# Altium schematic sheet Flash.SchDoc
size A4
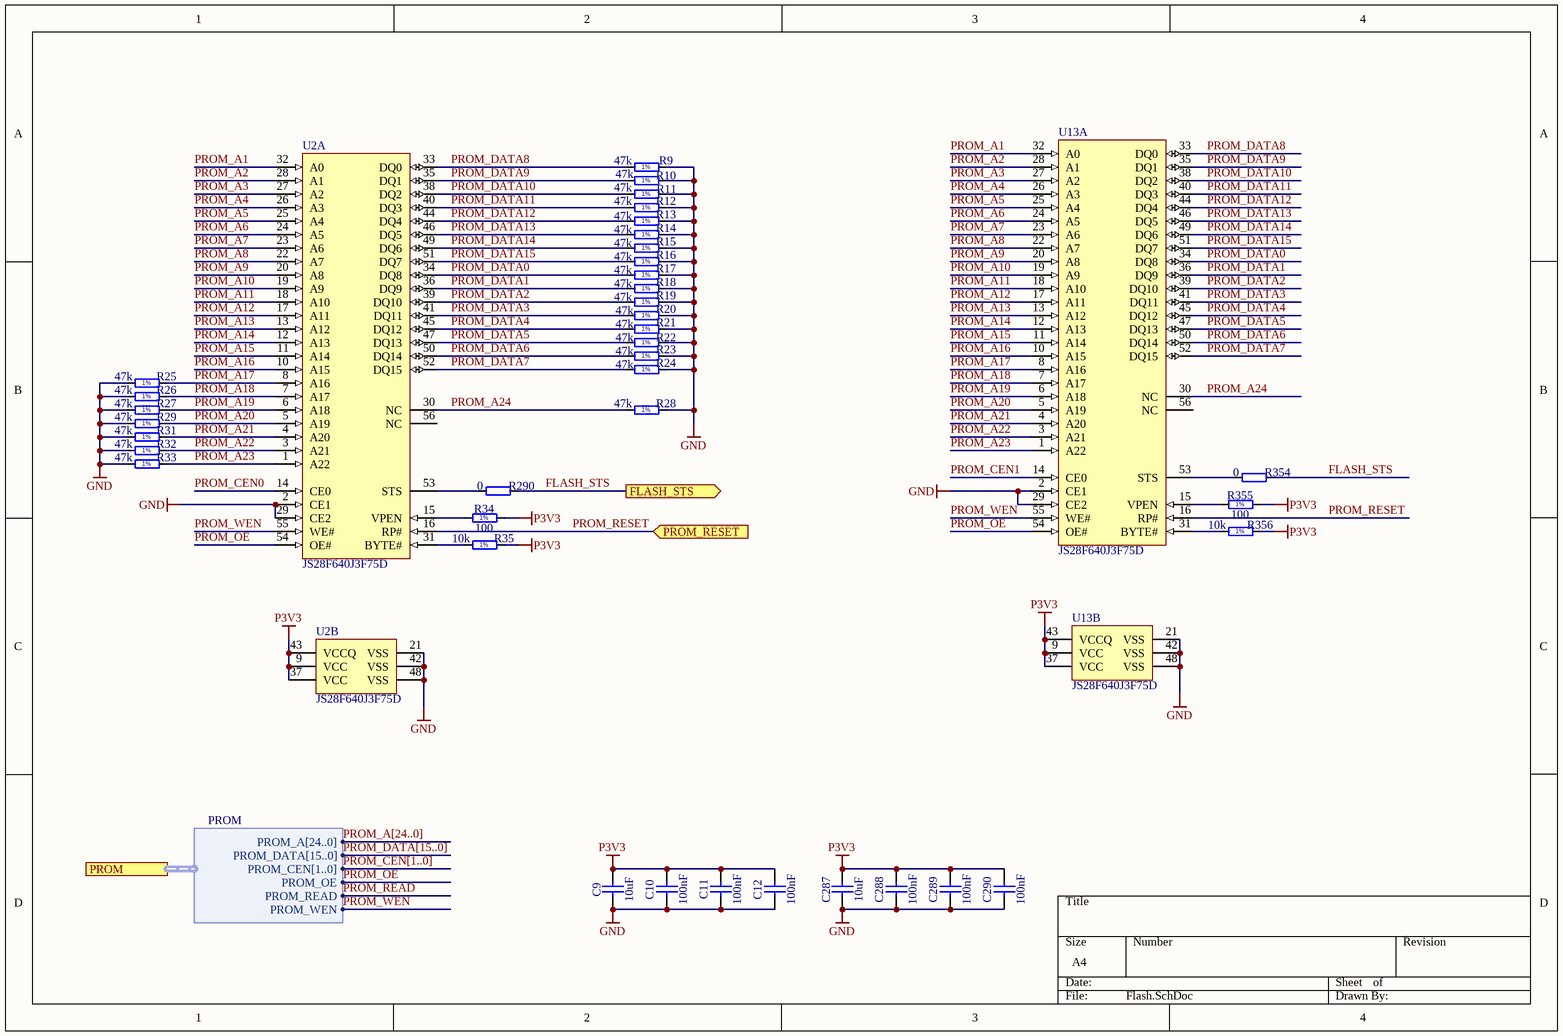
[diagram p0: Flash.SchDoc]

## Parts
C9  10uF  [CAPC2012X135N]
C10  100nF  [CAPC0603X33N]
C11  100nF  [CAPC0603X33N]
C12  100nF  [CAPC0603X33N]
C287  10uF  [CAPC2012X135N]
C288  100nF  [CAPC0603X33N]
C289  100nF  [CAPC0603X33N]
C290  100nF  [CAPC0603X33N]
R9  47k  [RESC1005X40N]
R10  47k  [RESC1005X40N]
R11  47k  [RESC1005X40N]
R12  47k  [RESC1005X40N]
R13  47k  [RESC1005X40N]
R14  47k  [RESC1005X40N]
R15  47k  [RESC1005X40N]
R16  47k  [RESC1005X40N]
R17  47k  [RESC1005X40N]
R18  47k  [RESC1005X40N]
R19  47k  [RESC1005X40N]
R20  47k  [RESC1005X40N]
R21  47k  [RESC1005X40N]
R22  47k  [RESC1005X40N]
R23  47k  [RESC1005X40N]
R24  47k  [RESC1005X40N]
R25  47k  [RESC1005X40N]
R26  47k  [RESC1005X40N]
R27  47k  [RESC1005X40N]
R28  47k  [RESC1005X40N]
R29  47k  [RESC1005X40N]
R31  47k  [RESC1005X40N]
R32  47k  [RESC1005X40N]
R33  47k  [RESC1005X40N]
R34  100  [RESC1005X40N]
R35  10k  [RESC1005X40N]
R290  0  [RESC0603X28N]
R354  0  [RESC0603X28N]
R355  100  [RESC1005X40N]
R356  10k  [RESC1005X40N]
U2  JS28F640J3F75D  [MICT-JS-56_N]  (parts A,B of 2)
U13  JS28F640J3F75D  [MICT-JS-56_N]  (parts A,B of 2)

## Ports
FLASH_STS (out), PROM (harness PROM), PROM_RESET (in)

## Harnesses
PROM: PROM_A[24..0], PROM_DATA[15..0], PROM_CEN[1..0], PROM_OE, PROM_READ, PROM_WEN

## Nets
GND: C9.1 C10.2 C11.2 C12.2 C287.1 C288.2 C289.2 C290.2 R9.2 R10.2 R11.2 R12.2 R13.2 R14.2 R15.2 R16.2 R17.2 R18.2 R19.2 R20.2 R21.2 R22.2 R23.2 R24.2 R25.1 R26.1 R27.1 R28.2 R29.1 R31.1 R32.1 R33.1 U2.2(CE1) U2.21(VSS) U2.29(CE2) U2.42(VSS) U2.48(VSS) U13.2(CE1) U13.21(VSS) U13.29(CE2) U13.42(VSS) U13.48(VSS)
P3V3: C9.2 C10.1 C11.1 C12.1 C287.2 C288.1 C289.1 C290.1 R34.2 R35.2 R355.2 R356.2 U2.9(VCC) U2.37(VCC) U2.43(VCCQ) U13.9(VCC) U13.37(VCC) U13.43(VCCQ)
FLASH_STS: R290.2 R354.2 ; port FLASH_STS
PROM_A1: U2.32(A0) U13.32(A0)
PROM_A2: U2.28(A1) U13.28(A1)
PROM_A3: U2.27(A2) U13.27(A2)
PROM_A4: U2.26(A3) U13.26(A3)
PROM_A5: U2.25(A4) U13.25(A4)
PROM_A6: U2.24(A5) U13.24(A5)
PROM_A7: U2.23(A6) U13.23(A6)
PROM_A8: U2.22(A7) U13.22(A7)
PROM_A9: U2.20(A8) U13.20(A8)
PROM_A10: U2.19(A9) U13.19(A9)
PROM_A11: U2.18(A10) U13.18(A10)
PROM_A12: U2.17(A11) U13.17(A11)
PROM_A13: U2.13(A12) U13.13(A12)
PROM_A14: U2.12(A13) U13.12(A13)
PROM_A15: U2.11(A14) U13.11(A14)
PROM_A16: U2.10(A15) U13.10(A15)
PROM_A17: R25.2 U2.8(A16) U13.8(A16)
PROM_A18: R26.2 U2.7(A17) U13.7(A17)
PROM_A19: R27.2 U2.6(A18) U13.6(A18)
PROM_A20: R29.2 U2.5(A19) U13.5(A19)
PROM_A21: R31.2 U2.4(A20) U13.4(A20)
PROM_A22: R32.2 U2.3(A21) U13.3(A21)
PROM_A23: R33.2 U2.1(A22) U13.1(A22)
PROM_A24: R28.1 U2.30(NC) U13.30(NC)
PROM_CEN0: U2.14(CE0)
PROM_CEN1: U13.14(CE0)
PROM_DATA0: R17.1 U2.34(DQ8) U13.34(DQ8)
PROM_DATA1: R18.1 U2.36(DQ9) U13.36(DQ9)
PROM_DATA2: R19.1 U2.39(DQ10) U13.39(DQ10)
PROM_DATA3: R20.1 U2.41(DQ11) U13.41(DQ11)
PROM_DATA4: R21.1 U2.45(DQ12) U13.45(DQ12)
PROM_DATA5: R22.1 U2.47(DQ13) U13.47(DQ13)
PROM_DATA6: R23.1 U2.50(DQ14) U13.50(DQ14)
PROM_DATA7: R24.1 U2.52(DQ15) U13.52(DQ15)
PROM_DATA8: R9.1 U2.33(DQ0) U13.33(DQ0)
PROM_DATA9: R10.1 U2.35(DQ1) U13.35(DQ1)
PROM_DATA10: R11.1 U2.38(DQ2) U13.38(DQ2)
PROM_DATA11: R12.1 U2.40(DQ3) U13.40(DQ3)
PROM_DATA12: R13.1 U2.44(DQ4) U13.44(DQ4)
PROM_DATA13: R14.1 U2.46(DQ5) U13.46(DQ5)
PROM_DATA14: R15.1 U2.49(DQ6) U13.49(DQ6)
PROM_DATA15: R16.1 U2.51(DQ7) U13.51(DQ7)
PROM_OE: U2.54(OE#) U13.54(OE#) ; port PROM.PROM_OE
PROM_READ: port PROM.PROM_READ
PROM_RESET: U2.16(RP#) U13.16(RP#) ; port PROM_RESET
PROM_WEN: U2.55(WE#) U13.55(WE#) ; port PROM.PROM_WEN
NetR34_1: R34.1 U2.15(VPEN)
NetR35_1: R35.1 U2.31(BYTE#)
NetR290_1: R290.1 U2.53(STS)
NetR354_1: R354.1 U13.53(STS)
NetR355_1: R355.1 U13.15(VPEN)
NetR356_1: R356.1 U13.31(BYTE#)

Not connected (* = marked no-connect by the designer): U2 56(NC); U13 56(NC)

## Buses and harness runs
bus PROM_A[24..0]
bus PROM_CEN[1..0]
bus PROM_DATA[15..0]

## Notes on the sheet
- (in symbol R0402_10K_1%_0.0625W_100PPM) 1%
- (in symbol R0402_47K_1%_0.0625W_100PPM) 1%
- (in symbol R0402_100R_1%_0.0625W_100PPM) 1%

## Library data of the parts
C9 C287 = CC0805_10UF_16V_10%_X5R: Non-polarised capacitor; Part Description: SMD Multilayer Chip Ceramic Capacitor; Manufacturer: GENERIC; Manufacturer1 Part Number: C0805C106K4PAC; Voltage: 16V; TC: X5R; Tolerance: ±10%; Part Number: CC0805_10UF_16V_10%_X5R; Component Kind: Standard; Component Type: Standard; Pin Count: 2; Value: 10uF; Status: Preferred; Manufacturer Part Number: CC0805_10UF_16V_10%_X5R; Case: 0805; Mounted: Yes; Socket: No; SMD: Yes; Sense: No; Manufacturer1 Example: KEMET; Manufacturer1 ComponentHeight: 1.4mm; HelpURL: \\cern.ch\dfs\Applications\Altium\Datasheets\CC1206_X5R_KEMET.pdf; Author: CERN DEM JLC; CreateDate: 03.12.2007; LatestRevisionDate: 03.12.2007
C10-C12 C288-C290 = CC0201_100NF_6.3V_10%_X5R: Non-polarised capacitor; Manufacturer: GENERIC; Part Description: SMD Multilayer Chip Ceramic Capacitor; Manufacturer1 Part Number: 02016D104KAT2A; Voltage: 6.3V; TC: X5R; Tolerance: ±10%; Part Number: CC0201_100NF_6.3V_10%_X5R; Component Kind: Standard; Component Type: Standard; Pin Count: 2; Value: 100nF; Status: Not Recommended; Manufacturer Part Number: CC0201_100NF_6.3V_10%_X5R; Case: 0201; Mounted: Yes; Socket: No; SMD: Yes; Sense: No; Manufacturer1 Example: AVX; Manufacturer1 ComponentHeight: 0.33mm; HelpURL: \\cern.ch\dfs\Applications\Altium\Datasheets\CC0201_X5R_AVX.pdf; Author: CERN DEM JLC; CreateDate: 03/12/2007; LatestRevisionDate: 03/12/2007
R9-R29 R31-R33 = R0402_47K_1%_0.0625W_100PPM: Resistor - 1%; Part Description: General Purpose Thick Film Chip Resistor; Manufacturer: GENERIC; Manufacturer1 Part Number: 232270675103L; TC: ±100ppm/°C; PressFit: No; Part Number: R0402_47K_1%_0.0625W_100PPM; Component Kind: Standard; Component Type: Standard; Pin Count: 2; Value: 47k; Status: Not Recommended; Power: 0.0625W; Tolerance: ±1%; Manufacturer Part Number: R0402_47K_1%_0.0625W_100PPM; Case: 0402; Mounted: Yes; Sense: No; Socket: No; SMD: Yes; Manufacturer1 Example: YAGEO PHYCOMP; Manufacturer1 ComponentHeight: 0.4mm; HelpURL: \\cern.ch\dfs\Applications\Altium\Datasheets\R0402_Phycomp_RC0402.pdf; Author: CERN DEM JLC; CreateDate: 03.12.2007; LatestRevisionDate: 17.10.2012
R34 R355 = R0402_100R_1%_0.0625W_100PPM: Resistor - 1%; Part Description: General Purpose Thick Film Chip Resistor; Manufacturer: GENERIC; Manufacturer1 Part Number: 232270671001L; TC: ±100ppm/°C; PressFit: No; Part Number: R0402_100R_1%_0.0625W_100PPM; Component Kind: Standard; Component Type: Standard; Pin Count: 2; Value: 100; Status: Not Recommended; Power: 0.0625W; Tolerance: ±1%; Manufacturer Part Number: R0402_100R_1%_0.0625W_100PPM; Case: 0402; Mounted: Yes; Sense: No; Socket: No; SMD: Yes; Manufacturer1 Example: YAGEO PHYCOMP; Manufacturer1 ComponentHeight: 0.4mm; HelpURL: \\cern.ch\dfs\Applications\Altium\Datasheets\R0402_Phycomp_RC0402.pdf; Author: CERN DEM JLC; CreateDate: 03.12.2007; LatestRevisionDate: 17.10.2012
R35 R356 = R0402_10K_1%_0.0625W_100PPM: Resistor - 1%; Manufacturer: GENERIC; Part Description: General Purpose Thick Film Chip Resistor; Manufacturer1 Part Number: 232270671003L; TC: ±100ppm/°C; PressFit: No; Manufacturer Part Number: R0402_10K_1%_0.0625W_100PPM; Part Number: R0402_10K_1%_0.0625W_100PPM; Tolerance: ±1%; Value: 10k; Component Kind: Standard; Component Type: Standard; Pin Count: 2; Status: Not Recommended; Power: 0.0625W; Case: 0402; Mounted: Yes; Sense: No; Socket: No; SMD: Yes; Manufacturer1 Example: YAGEO PHYCOMP; Manufacturer1 ComponentHeight: 0.4mm; HelpURL: \\cern.ch\dfs\Applications\Altium\Datasheets\R0402_Phycomp_RC0402.pdf; Author: CERN DEM JLC; CreateDate: 03/12/2007; LatestRevisionDate: 17/10/2012
R290 R354 = R0201_0R_JUMPER: Resistor; Part Description: 1A (0.05R Max DC Resistance) Zero Ohm Jumper; Manufacturer: GENERIC; Manufacturer1 Part Number: CRCW02010000Z0ED; PressFit: No; Part Number: R0201_0R_JUMPER; Component Kind: Standard; Component Type: Standard; Pin Count: 2; Value: 0; Status: Not Recommended; Manufacturer Part Number: R0201_0R_JUMPER; Case: 0201; Mounted: Yes; Sense: No; Socket: No; SMD: Yes; Manufacturer1 Example: VISHAY; Manufacturer1 ComponentHeight: 0.27mm; HelpURL: \\cern.ch\dfs\Applications\Altium\Datasheets\R0201_VISHAY_CRCW e3.pdf; Author: CERN DEM JLC; CreateDate: 19.11.2014; LatestRevisionDate: 08.01.2015
U2 U13 = CMP-0358-00064-1: 64 Mb (x8/x16) Parallel NOR Flash Memory, 75 ns, 2.7 to 3.6 V, 56-pin TSOP (JS), Tape & Reel; Part Family: J3Â; Manufacturer: Micron; Voltage: 2.7V-3.6VÂ; Speed: 75nsÂ; Density: 64MbÂ; Op Temp: -40C to +85CÂ; ComponentLink3Description: Package Specification; PackageVersion: Rev. 12; ComponentLink1URL: http://www.micron.com/; DatasheetVersion: Rev. 03; ComponentLink3URL: http://www.micron.com/~/media/Documents/Products/Data%20Sheet/NOR%20Flash/Parallel/P33/320003_P33_65nm_MLC_256MDiscrete_512MStack_DS.pdf; Width: x8/x16Â; RoHS: YesÂ; PackageDescription: 56-Pin TSOP, 18.4 X 14 mm, Pitch 0.5 mm; ComponentLink2Description: Datasheet; PartNumber: JS28F640J3F75D; PackageReference: MICT-JS-56Â; ComponentLink1Description: Manufacturer URL; ComponentLink2URL: http://www.micron.com/~/media/Documents/Products/Data%20Sheet/NOR%20Flash/Parallel/J3/208032_J3_65_SBC_DS.pdf; Mounting Technology: Surface Mount